# Altium schematic sheet Sheet2.SchDoc
size A
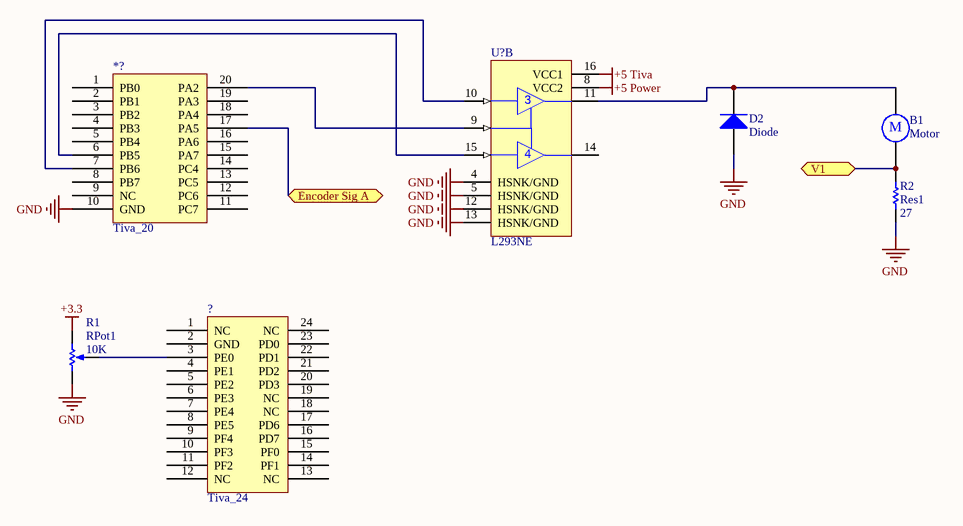
[diagram p0: Sheet2.SchDoc]

## Parts
*?  Tiva_20
?  Tiva_24
B1  Motor  [RB5-10.5]
D2  Diode  [DSO-C2/X3.3]
R1  RPot1  value 10K  [VR5]
R2  Res1  value 27  [AXIAL-0.3]
U?  L293NE  [DIP-16/X1.5]  (part B of 2)

## Ports
Encoder Sig A, V1

## Nets
+3.3: R1.2(BOT)
+5 Power: U?.8(VCC2)
+5 Tiva: U?.16(VCC1)
GND: *?.10(GND) D2.1(A) R1.1(TOP) R2.1 U?.4(HSNK/GND) U?.5(HSNK/GND) U?.12(HSNK/GND) U?.13(HSNK/GND)
Encoder Sig A: *?.17(PA5) ; port Encoder Sig A
V1: B1.2 R2.2 ; port V1
Net*?_6: *?.6(PB5) U?.15(4A)
Net*?_7: *?.7(PB6) U?.10(3A)
Net*?_20: *?.20(PA2) U?.9(3,4EN)
Net?_3: ?.3(PE0) R1.3(TAP)
NetB1_1: B1.1 D2.2(K) U?.11(3Y)

Not connected (* = marked no-connect by the designer): *? 1(PB0) 2(PB1) 3(PB2) 4(PB3) 5(PB4) 8(PB7) 9(NC) 11(PC7) 12(PC6) 13(PC5) 14(PC4) 15(PA7) 16(PA6) 18(PA4) 19(PA3); ? 1(NC) 2(GND) 4(PE1) 5(PE2) 6(PE3) 7(PE4) 8(PE5) 9(PF4) 10(PF3) 11(PF2) 12(NC) 13(NC) 14(PF1) 15(PF0) 16(PD7) 17(PD6) 18(NC) 19(NC) 20(PD3) 21(PD2) 22(PD1) 23(PD0) 24(NC); U? 14(4Y)

## Notes on the sheet
- (in symbol Motor) M

## Library data of the parts
*? = Tiva_20: Tiva Protection 20 Pin Connector
? = Tiva_24: Tiva Protection 24 Pin Connector
B1 = Motor: Motor, General Kind; Manufacturer: Generic Components; Published: 1999
D2 = Diode: Default Diode; Manufacturer: Generic Components; Class: Discrete; SubClass: Diode - Switching; Published: 08/06/2000; Publisher: Altium Hobart Technology Centre
R1 = RPot1: Potentiometer; Manufacturer: Generic Components; Class: Passive; Set Position: 0.5; Published: 08/06/2000; Publisher: Altium Hobart Technology Centre; SubClass: Potentiometer
R2 = Res1: Resistor; Manufacturer: Generic Components; Class: Passive; Published: 08/06/2000; Publisher: Altium Hobart Technology Centre; SubClass: Resistor
U? = L293NE: Quadruple Half-H Driver; Manufacturer: Texas Instruments; Class: Interface; SubClass: Peripheral Driver; Published: 15/05/2002; Publisher: Altium Hobart Technology Centre